# EAGLE schematic lpc_serial (EAGLE 7.7.0)
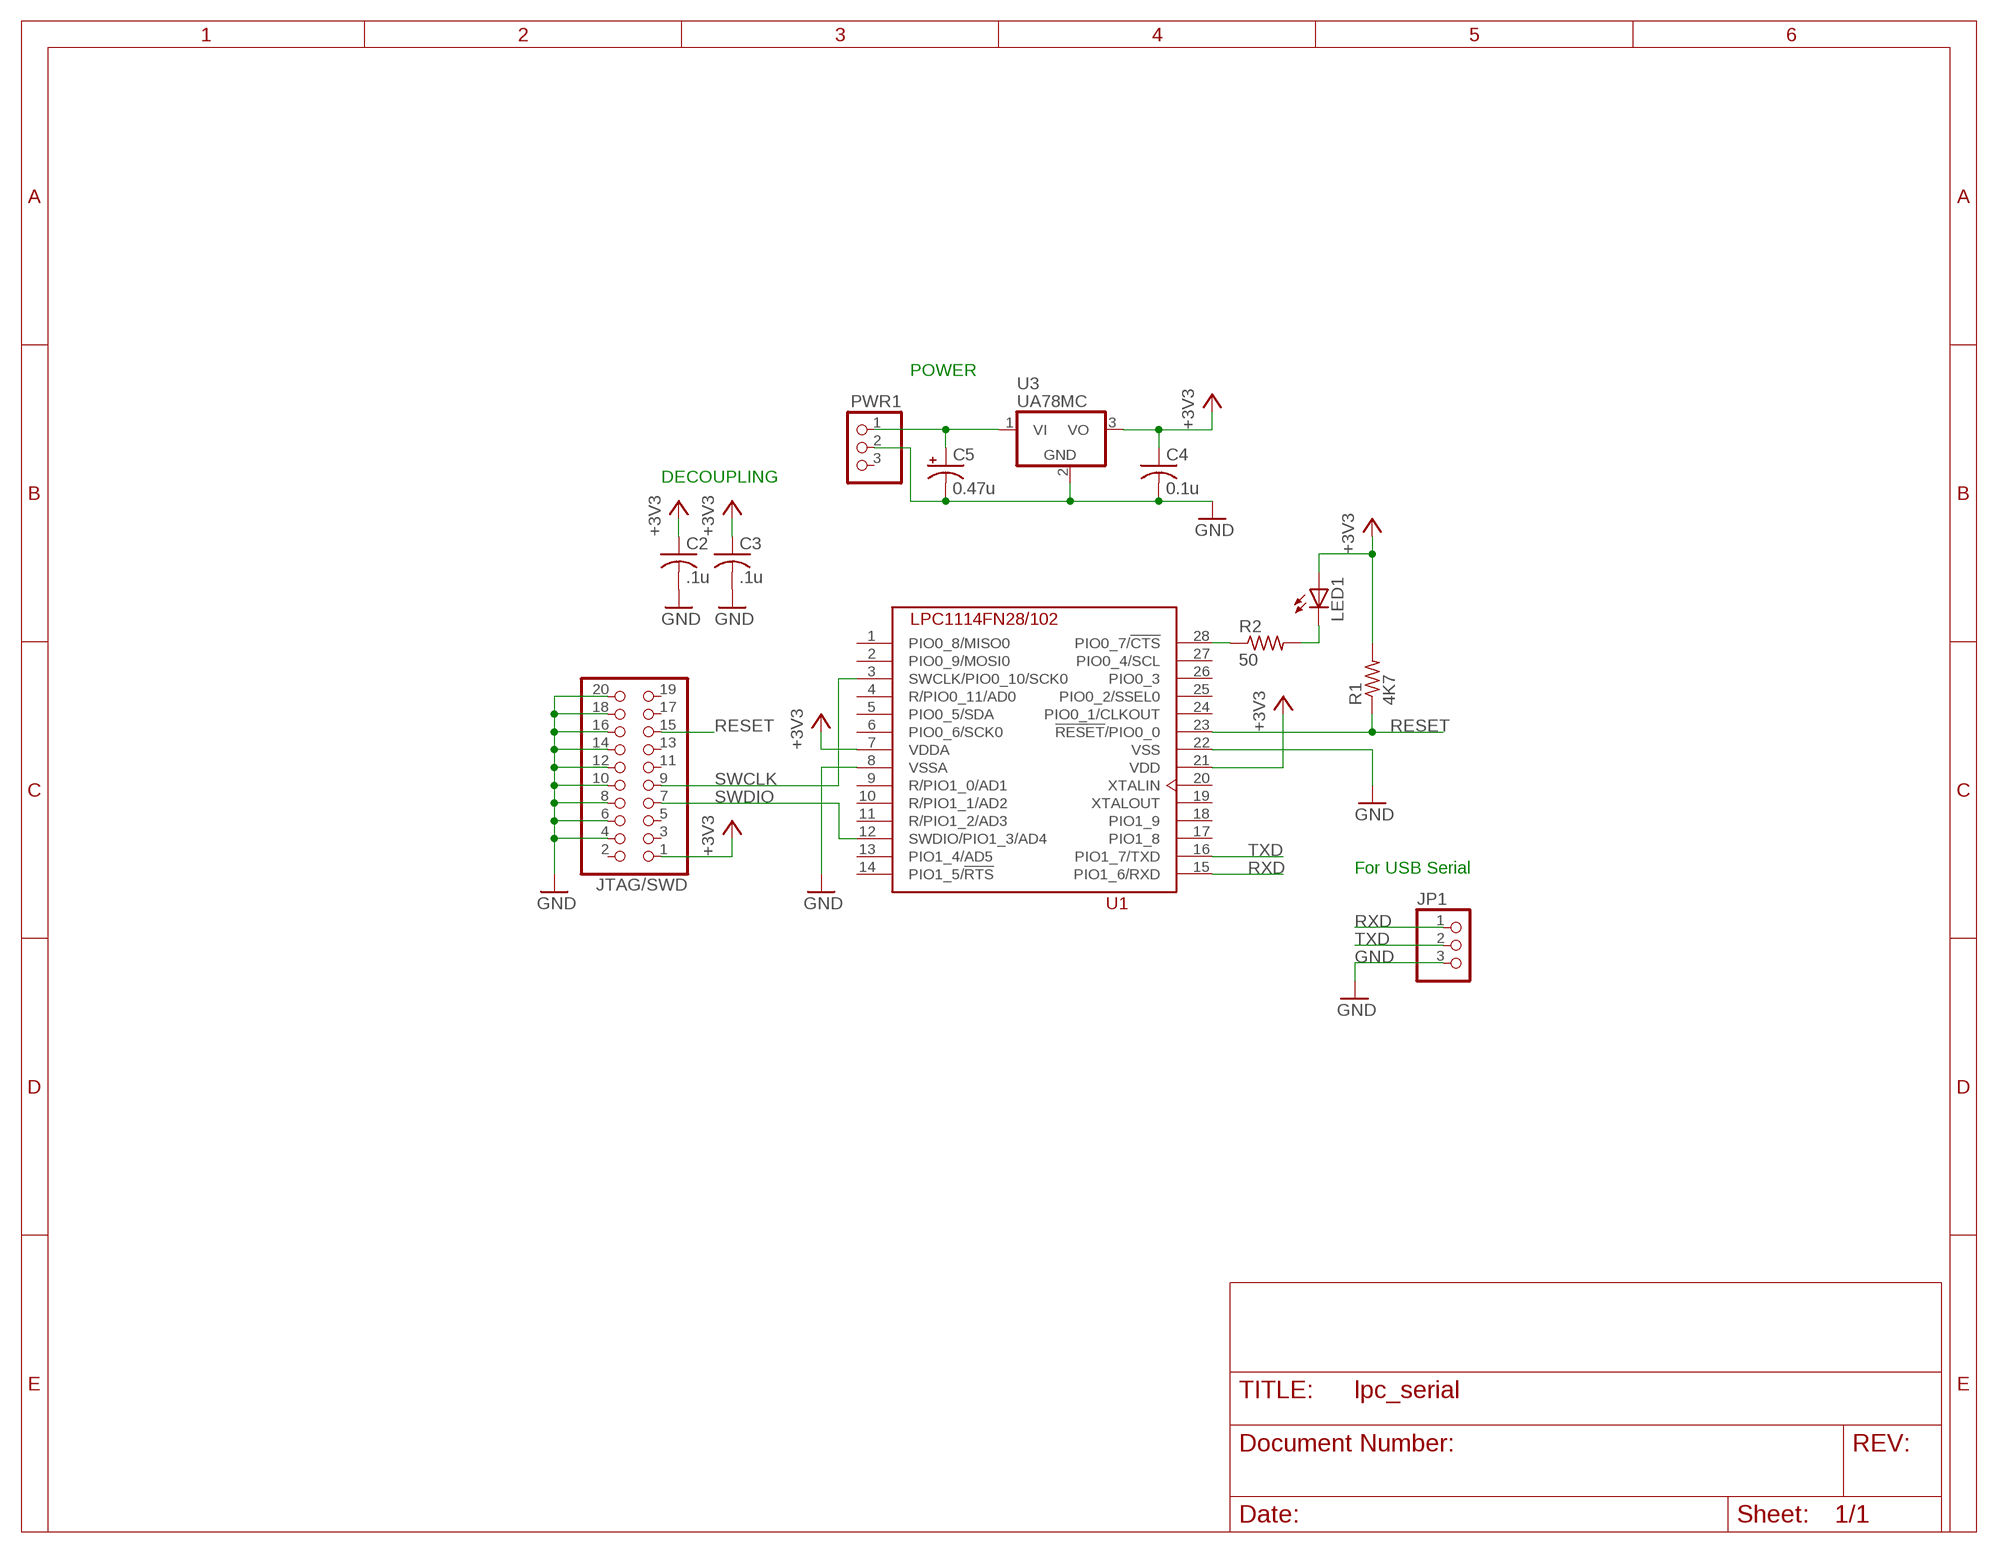
[diagram p0: schematic, sheet 1]

## Parts
C2  .1u  C-US050-024X044  [C050-024X044]
C3  .1u  C-US050-024X044  [C050-024X044]
C4  0.1u  C-US050-024X044  [C050-024X044]
C5  0.47u  CPOL-USE2-5  [E2-5]
JP1  PINHD-1X3  [1X03]
JTAG/SWD  PINHD-2X10  [2X10]
LED1  LED10MM  [LED10MM]
PWR1  PINHD-1X3  [1X03]
R1  4K7  R-US_0207/10  [0207/10]
R2  50  R-US_0207/10  [0207/10]
U1  LPC1114FN28/102  [DIL28-6]
U3  UA78MC  [TO220V]

## Nets
+3V3: C2.1 C3.1 C4.1 JTAG/SWD.1 LED1.A R1.2 U1.7(VDDA) U1.21(VDD) U3.3(VO)
GND: C2.2 C3.2 C4.2 C5.- JP1.3 JTAG/SWD.4 JTAG/SWD.6 JTAG/SWD.8 JTAG/SWD.10 JTAG/SWD.12 JTAG/SWD.14 JTAG/SWD.16 JTAG/SWD.18 JTAG/SWD.20 PWR1.2 U1.8(VSSA) U1.22(VSS) U3.2(GND)
N$1: LED1.K(C) R2.2
N$3: R2.1 U1.28(PIO0_7/!CTS)
N$4: C5.+ PWR1.1 U3.1(VI)
RESET: JTAG/SWD.15 R1.1 U1.23(!RESET!/PIO0_0)
RXD: JP1.1 U1.15(PIO1_6/RXD)
SWCLK: JTAG/SWD.9 U1.3(SWCLK/PIO0_10/SCK0)
SWDIO: JTAG/SWD.7 U1.12(SWDIO/PIO1_3/AD4)
TXD: JP1.2 U1.16(PIO1_7/TXD)
Unconnected: JTAG/SWD.2 JTAG/SWD.3 JTAG/SWD.5 JTAG/SWD.11 JTAG/SWD.13 JTAG/SWD.17 JTAG/SWD.19 PWR1.3 U1.1(PIO0_8/MISO0) U1.2(PIO0_9/MOSI0) U1.4(R/PIO0_11/AD0) U1.5(PIO0_5/SDA) U1.6(PIO0_6/SCK0) U1.9(R/PIO1_0/AD1) U1.10(R/PIO1_1/AD2) U1.11(R/PIO1_2/AD3) U1.13(PIO1_4/AD5) U1.14(PIO1_5/!RTS) U1.17(PIO1_8) U1.18(PIO1_9) U1.19(XTALOUT) U1.20(XTALIN) U1.24(PIO0_1/CLKOUT) U1.25(PIO0_2/SSEL0) U1.26(PIO0_3) U1.27(PIO0_4/SCL)

## Notes on the sheet
- POWER
- DECOUPLING
- For USB Serial

## Library data of the parts
C2-C4 = rcl:C-US: CAPACITOR, American symbol
C5 = rcl:CPOL-US: POLARIZED CAPACITOR, American symbol
JP1 PWR1 = pinhead:PINHD-1X3: PIN HEADER
JTAG/SWD = pinhead:PINHD-2X10: PIN HEADER
LED1 = led:LED: LED OSRAM: - CHIPLED LG R971, LG N971, LY N971, LG Q971, LY Q971, LO R971, LY R971 LH N974, LH R974 LS Q976, LO Q976, LY Q976 LO Q996 - Hyper CHIPLED LW Q18S LB Q993, LB Q99A, LB R99A - SideLED LS A670, LO A670, LY A670, LG A670, LP A670 LB A673, LV A673, LT A673, LW A673 LH A674 LY A675 LS A676, LA A676, LO A676, LY A676, LW A676 LS A679, LY A679, LG A679 - Hyper Micro SIDELED® LS Y876, LA Y876, LO Y876, LY Y876 LT Y87S - SmartLED LW L88C, LW L88S LB L89C, LB L89S, LG L890 LS L89K, LO L89K, LY L89K LS L896, LA L896, LO L896, LY L896 - TOPLED LS T670, LO T670, LY T670, LG T670, LP T670 LSG T670, LSP T670, LSY T670, LOP T670, LYG T670 LG T671, LOG T671, LSG T671 LB T673, LV T673, LT T673, LW T673 LH T674 LS T676, LA T676, LO T676, LY T676, LB T676, LH T676, LSB T676, LW T676 LB T67C, LV T67C, LT T67C, LS T67K, LO T67K, LY T67K, LW E67C LS E67B, LA E67B, LO E67B, LY E67B, LB E67C, LV E67C, LT E67C LW T67C LS T679, LY T679, LG T679 LS T770, LO T770, LY T770, LG T770, LP T770 LB T773, LV T773, LT T773, LW T773 LH T774 LS E675, LA E675, LY E675, LS T675 LS T776, LA T776, LO T776, LY T776, LB T776 LHGB T686 LT T68C, LB T68C - Hyper Mini TOPLED® LB M676 - Mini TOPLED Santana® LG M470 LS M47K, LO M47K, LY M47K Source: http://www.osram.convergy.de LUXEON: - LUMILED® LXK2-PW12-R00, LXK2-PW12-S00, LXK2-PW14-U00, LXK2-PW14-V00 LXK2-PM12-R00, LXK2-PM12-S00, LXK2-PM14-U00 LXK2-PE12-Q00, LXK2-PE12-R00, LXK2-PE12-S00, LXK2-PE14-T00, LXK2-PE14-U00 LXK2-PB12-K00, LXK2-PB12-L00, LXK2-PB12-M00, LXK2-PB14-N00, LXK2-PB14-P00, LXK2-PB14-Q00 LXK2-PR12-L00, LXK2-PR12-M00, LXK2-PR14-Q00, LXK2-PR14-R00 LXK2-PD12-Q00, LXK2-PD12-R00, LXK2-PD12-S00 LXK2-PH12-R00, LXK2-PH12-S00 LXK2-PL12-P00, LXK2-PL12-Q00, LXK2-PL12-R00 Source: www.luxeon.com KINGBRIGHT: KA-3528ASYC Source: www.kingbright.com
R1 R2 = rcl:R-US_: RESISTOR, American symbol
U1 = lpc_11xx:LPC1114FN28/102
U3 = lpc_11xx:UA78M*C